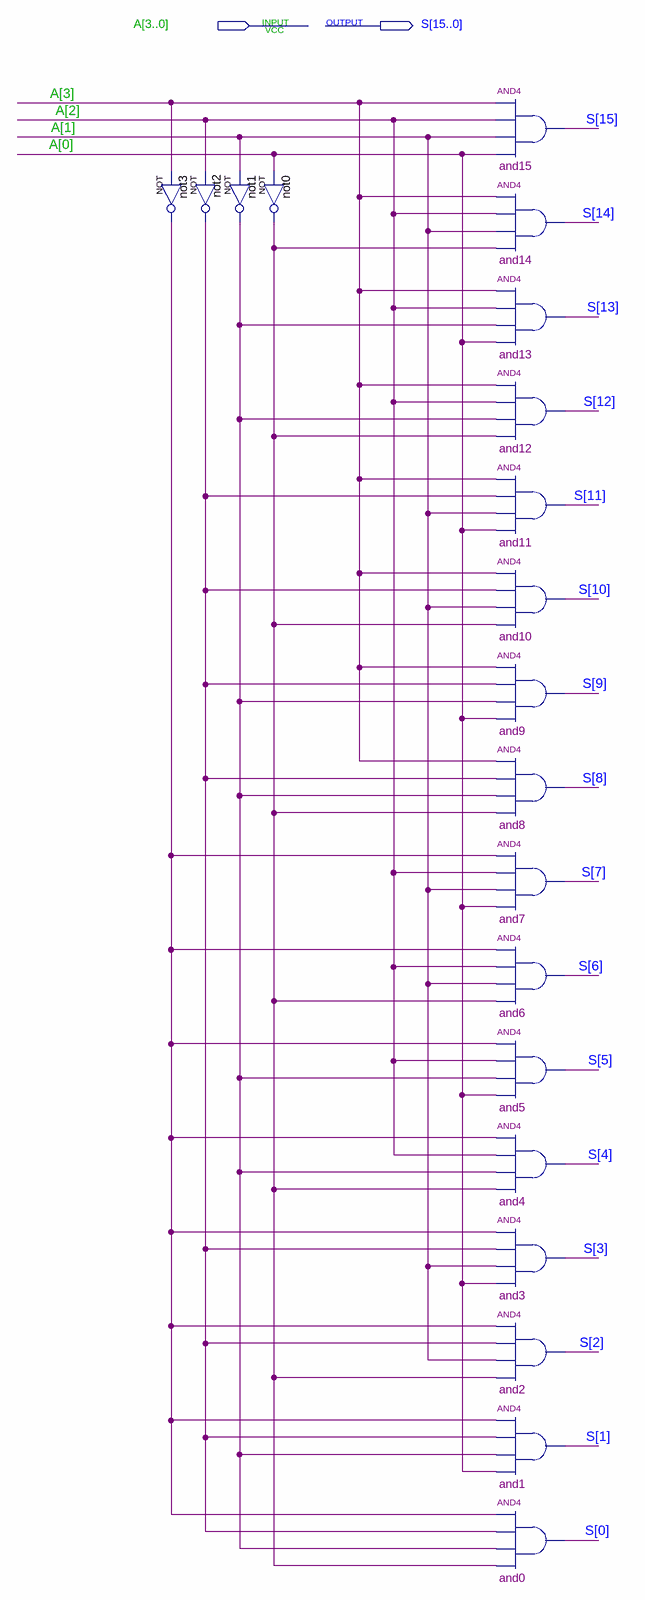
[diagram p0: schematic sheet]
// Quartus schematic decoder416.bdf as structural Verilog: 20 symbols, 2 pins
module decoder416 (
  input  [3:0] A,
  output [15:0] S
);

  wire not0_out, not1_out, not2_out, not3_out;

  not not3 (not3_out, A[3]);
  not not1 (not1_out, A[1]);
  not not2 (not2_out, A[2]);
  not not0 (not0_out, A[0]);
  and and15 (S[15], A[3], A[2], A[1], A[0]);
  and and14 (S[14], A[3], A[2], A[1], not0_out);
  and and13 (S[13], A[3], A[2], not1_out, A[0]);
  and and12 (S[12], A[3], A[2], not1_out, not0_out);
  and and11 (S[11], A[3], not2_out, A[1], A[0]);
  and and10 (S[10], A[3], not2_out, A[1], not0_out);
  and and9 (S[9], A[3], not2_out, not1_out, A[0]);
  and and8 (S[8], A[3], not2_out, not1_out, not0_out);
  and and7 (S[7], not3_out, A[2], A[1], A[0]);
  and and6 (S[6], not3_out, A[2], A[1], not0_out);
  and and5 (S[5], not3_out, A[2], not1_out, A[0]);
  and and4 (S[4], not3_out, A[2], not1_out, not0_out);
  and and3 (S[3], not3_out, not2_out, A[1], A[0]);
  and and2 (S[2], not3_out, not2_out, A[1], not0_out);
  and and1 (S[1], not3_out, not2_out, not1_out, A[0]);
  and and0 (S[0], not3_out, not2_out, not1_out, not0_out);
endmodule
